# Altium schematic sheet digtal.SchDoc
size A4
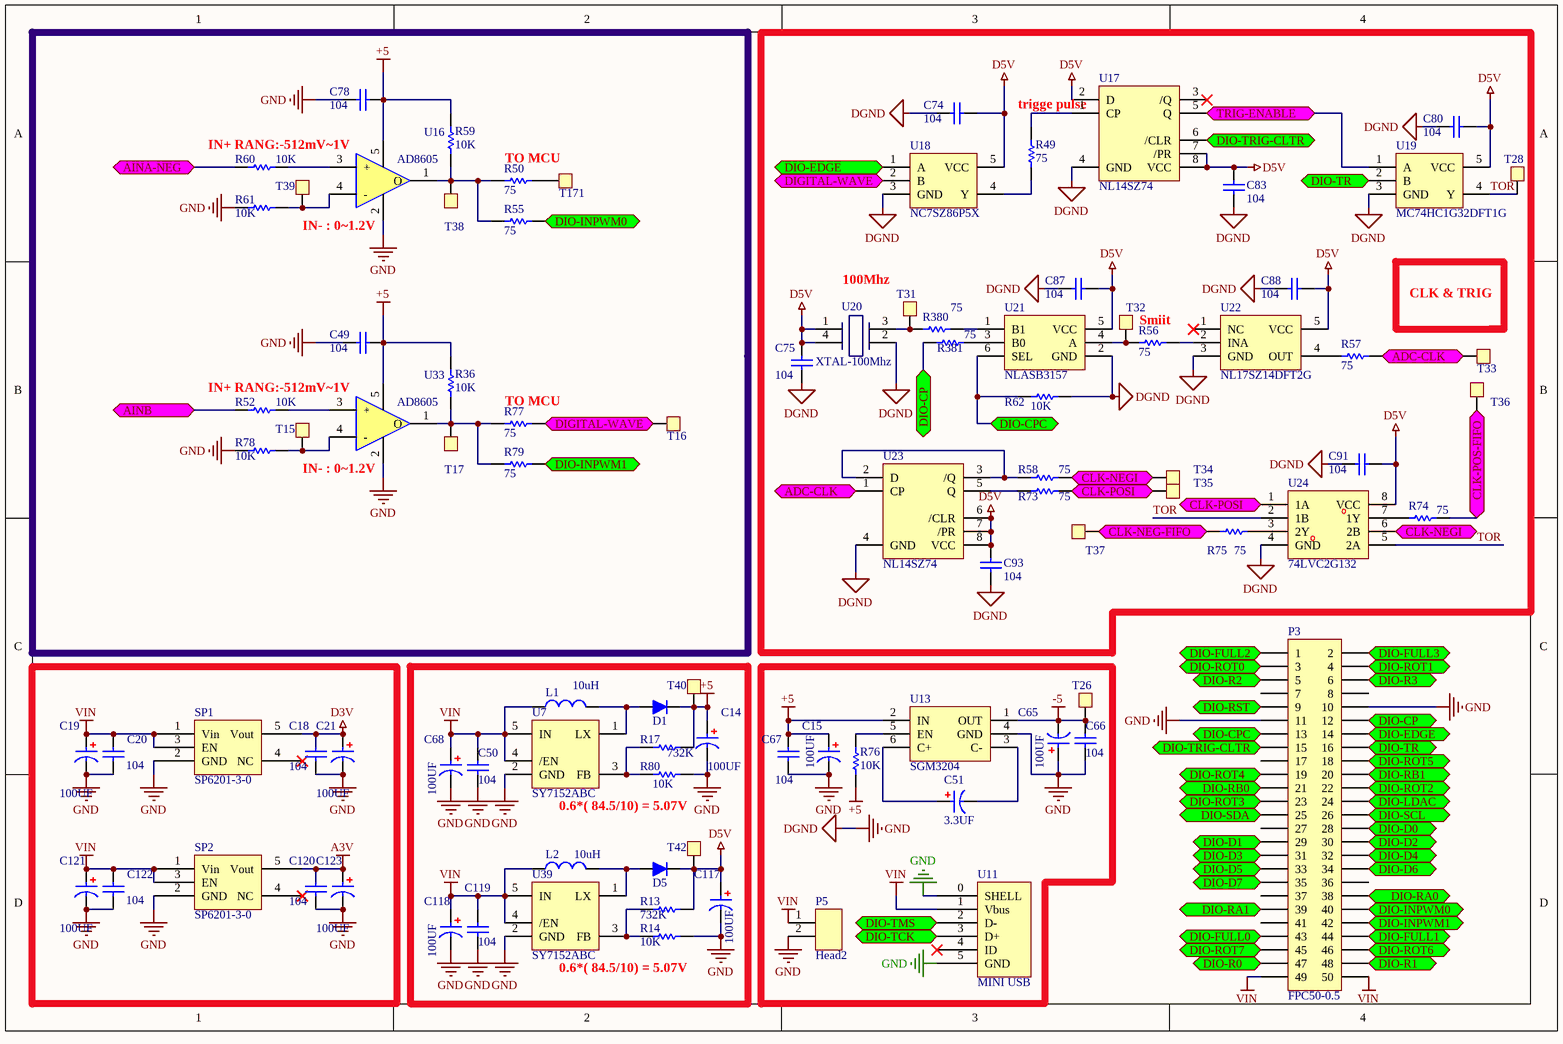
[diagram p0: digtal.SchDoc]

## Parts
C14  100UF  [CAP-T-3630]
C15  100UF  [CAP-T-3630]
C18  C104  [0402]  (value not drawn)
C19  100UF  [CAP-T-3630]
C20  C104  [0402]  (value not drawn)
C21  100UF  [CAP-T-3630]
C49  C104  [0402]  (value not drawn)
C50  C104  [0402]  (value not drawn)
C51  3.3UF  [0603C]
C65  100UF  [CAP-T-3630]
C66  C104  [0402]  (value not drawn)
C67  C104  [0402]  (value not drawn)
C68  100UF  [CAP-T-3630]
C74  C104  [0402]  (value not drawn)
C75  C104  [0402]  (value not drawn)
C78  C104  [0402]  (value not drawn)
C80  C104  [0402]  (value not drawn)
C83  C104  [0402]  (value not drawn)
C87  C104  [0402]  (value not drawn)
C88  C104  [0402]  (value not drawn)
C91  C104  [0402]  (value not drawn)
C93  C104  [0402]  (value not drawn)
C117  100UF  [CAP-T-3630]
C118  100UF  [CAP-T-3630]
C119  C104  [0402]  (value not drawn)
C120  C104  [0402]  (value not drawn)
C121  100UF  [CAP-T-3630]
C122  C104  [0402]  (value not drawn)
C123  100UF  [CAP-T-3630]
D1  1N5918WS  [SOD23-322F]  (value not drawn)
D5  1N5918WS  [SOD23-322F]  (value not drawn)
L1  10uH  [0805]
L2  10uH  [0805]
P3  FPC50-0.5  [FPC50-0.5]
P5  Head2  [HEAD2]
R13  732K  [0402]
R14  10K  [0402]
R17  732K  [0402]
R36  10K  [0402]
R49  75  [0402]
R50  75  [0402]
R52  10K  [0402]
R55  75  [0402]
R56  75  [0402]
R57  75  [0402]
R58  75  [0402]
R59  10K  [0402]
R60  10K  [0402]
R61  10K  [0402]
R62  10K  [0402]
R73  75  [0402]
R74  75  [0402]
R75  75  [0402]
R76  R10K  [0402]  (value not drawn)
R77  75  [0402]
R78  10K  [0402]
R79  75  [0402]
R80  10K  [0402]
R380  75  [0402]
R381  75  [0402]
SP1  SP6201-3-0  [SOT23-5]
SP2  SP6201-3-0  [SOT23-5]
T15  TP  [TEST_POINT]  (value not drawn)
T16  TP  [TEST_POINT]  (value not drawn)
T17  TP  [TEST_POINT]  (value not drawn)
T26  TP  [TEST_POINT]  (value not drawn)
T28  TP  [TEST_POINT]  (value not drawn)
T31  TP  [TEST_POINT]  (value not drawn)
T32  TP  [TEST_POINT]  (value not drawn)
T33  TP  [TEST_POINT]  (value not drawn)
T34  TP  [TEST_POINT]  (value not drawn)
T35  TP  [TEST_POINT]  (value not drawn)
T36  TP  [TEST_POINT]  (value not drawn)
T37  TP  [TEST_POINT]  (value not drawn)
T38  TP  [TEST_POINT]  (value not drawn)
T39  TP  [TEST_POINT]  (value not drawn)
T40  TP  [TEST_POINT]  (value not drawn)
T42  TP  [TEST_POINT]  (value not drawn)
T171  TP  [TEST_POINT]  (value not drawn)
U7  SY7152ABC  [SOT23-6]
U11  MINI USB  [Micro_USB_t]
U13  SGM3204  [SOT23-6]
U16  AD8605  [SOT23-5]
U17  NL14SZ74  [VFSOP-8]
U18  NC7SZ86P5X  [sc70-5]
U19  MC74HC1G32DFT1G  [SC70-5]
U20  XTAL-100Mhz  [7050]
U21  NLASB3157  [SC-88]
U22  NL17SZ14DFT2G  [SC70-5]
U23  NL14SZ74  [VFSOP-8]
U24  74LVC2G132  [VFSOP-8]
U33  AD8605  [SOT23-5]
U39  SY7152ABC  [SOT23-6]

## Ports
ADC-CLK, AINA-NEG, AINB, CLK-NEG-FIFO, CLK-NEGI, CLK-POS-FIFO, CLK-POSI, DIGITAL-WAVE, DIO-CP, DIO-CPC, DIO-D0, DIO-D1, DIO-D2, DIO-D3, DIO-D4, DIO-D5, DIO-D6, DIO-D7, DIO-EDGE, DIO-FULL0, DIO-FULL1, DIO-FULL2, DIO-FULL3, DIO-INPWM0, DIO-INPWM1, DIO-LDAC, DIO-R0, DIO-R1, DIO-R2, DIO-R3, DIO-RA0, DIO-RA1, DIO-RB0, DIO-RB1, DIO-ROT0, DIO-ROT1, DIO-ROT2, DIO-ROT3, DIO-ROT4, DIO-ROT5, DIO-ROT6, DIO-ROT7, DIO-RST, DIO-SCL, DIO-SDA, DIO-TCK, DIO-TMS, DIO-TR, DIO-TRIG-CLTR, TRIG-ENABLE

## Nets
+5: C14.1 C15.1 C49.1 C67.1 C78.1 D1.2(K) R17.2 R36.1 R59.1 R76.1 T40.1(R) U13.2(IN) U16.5(V+) U33.5(V+)
-5: C65.2 C66.1 T26.1(R) U13.1(OUT)
A3V: C120.1 C123.1 SP2.5(Vout)
D3V: C18.1 C21.1 SP1.5(Vout)
D5V: C74.1 C75.1 C80.1 C83.1 C87.1 C88.1 C91.1 C93.1 C117.1 D5.2(K) R13.2 T42.1(R) U17.2(D) U17.7(/PR) U17.8(VCC) U18.5(VCC) U19.5(VCC) U20.1 U20.4 U21.5(VCC) U22.5(VCC) U23.6(/CLR) U23.7(/PR) U23.8(VCC) U24.8(VCC)
DGND: C14.2 C15.2 C18.2 C19.2 C20.2 C21.2 C49.2 C50.2 C65.1 C66.2 C67.2 C68.2 C74.2 C75.2 C78.2 C80.2 C83.2 C87.2 C88.2 C91.2 C93.2 C117.2 C118.2 C119.2 C120.2 C121.2 C122.2 C123.2 P3.10 P3.11 P5.2 R14.1 R61.1 R62.2 R78.1 R80.1 SP1.2(GND) SP2.2(GND) U7.2(GND) U11.0(SHELL) U11.5(GND) U13.4(GND) U16.2(V-) U17.4(GND) U18.3(GND) U19.3(GND) U20.2 U21.2(GND) U22.3(GND) U23.4(GND) U24.4(GND) U33.2(V-) U39.2(GND)  [also labelled GND]
VIN: C19.1 C20.1 C50.1 C68.1 C118.1 C119.1 C121.1 C122.1 L1.1 L2.1 P3.49 P3.50 P5.1 SP1.1(Vin) SP1.3(EN) SP2.1(Vin) SP2.3(EN) U7.4(/EN) U7.5(IN) U11.1(Vbus) U39.4(/EN) U39.5(IN)
ADC-CLK: R57.1 T33.1(R) U23.1(CP) ; port ADC-CLK
AINA-NEG: R60.1 ; port AINA-NEG
AINB: R52.1 ; port AINB
CLK-NEG-FIFO: R75.2 T37.1(R) ; port CLK-NEG-FIFO
CLK-NEGI: R58.1 T34.1(R) U24.6(2B) ; port CLK-NEGI
CLK-POS-FIFO: R74.1 T36.1(R) ; port CLK-POS-FIFO
CLK-POSI: R73.1 T35.1(R) U24.1(1A) ; port CLK-POSI
DIGITAL-WAVE: R77.2 T16.1(R) U18.2(B) ; port DIGITAL-WAVE
DIO-CP: P3.12 R381.2 ; port DIO-CP
DIO-CPC: P3.13 R62.1 U21.6(SEL) ; port DIO-CPC
DIO-D0: P3.28 ; port DIO-D0
DIO-D1: P3.29 ; port DIO-D1
DIO-D2: P3.30 ; port DIO-D2
DIO-D3: P3.31 ; port DIO-D3
DIO-D4: P3.32 ; port DIO-D4
DIO-D5: P3.33 ; port DIO-D5
DIO-D6: P3.34 ; port DIO-D6
DIO-D7: P3.35 ; port DIO-D7
DIO-EDGE: P3.14 U18.1(A) ; port DIO-EDGE
DIO-FULL0: P3.43 ; port DIO-FULL0
DIO-FULL1: P3.44 ; port DIO-FULL1
DIO-FULL2: P3.1 ; port DIO-FULL2
DIO-FULL3: P3.2 ; port DIO-FULL3
DIO-INPWM0: P3.40 R55.2 ; port DIO-INPWM0
DIO-INPWM1: P3.42 R79.2 ; port DIO-INPWM1
DIO-LDAC: P3.24 ; port DIO-LDAC
DIO-R0: P3.47 ; port DIO-R0
DIO-R1: P3.48 ; port DIO-R1
DIO-R2: P3.5 ; port DIO-R2
DIO-R3: P3.6 ; port DIO-R3
DIO-RA0: P3.38 ; port DIO-RA0
DIO-RA1: P3.39 ; port DIO-RA1
DIO-RB0: P3.21 ; port DIO-RB0
DIO-RB1: P3.20 ; port DIO-RB1
DIO-ROT0: P3.3 ; port DIO-ROT0
DIO-ROT1: P3.4 ; port DIO-ROT1
DIO-ROT2: P3.22 ; port DIO-ROT2
DIO-ROT3: P3.23 ; port DIO-ROT3
DIO-ROT4: P3.19 ; port DIO-ROT4
DIO-ROT5: P3.18 ; port DIO-ROT5
DIO-ROT6: P3.46 ; port DIO-ROT6
DIO-ROT7: P3.45 ; port DIO-ROT7
DIO-RST: P3.9 ; port DIO-RST
DIO-SCL: P3.26 ; port DIO-SCL
DIO-SDA: P3.25 ; port DIO-SDA
DIO-TCK: U11.3(D+) ; port DIO-TCK
DIO-TMS: U11.2(D-) ; port DIO-TMS
DIO-TR: P3.16 U19.2(B) ; port DIO-TR
DIO-TRIG-CLTR: P3.15 U17.6(/CLR) ; port DIO-TRIG-CLTR
TOR: T28.1(R) U19.4(Y) U24.2(1B) U24.5(2A)
TRIG-ENABLE: U17.5(Q) U19.1(A) ; port TRIG-ENABLE
NetC51_1: C51.1 U13.6(C+)
NetC51_2: C51.2 U13.3(C-)
NetD1_1: D1.1(A) L1.2 U7.1(LX)
NetD5_1: D5.1(A) L2.2 U39.1(LX)
NetR13_1: R13.1 R14.2 U39.3(FB)
NetR17_1: R17.1 R80.2 U7.3(FB)
NetR36_2: R36.2 R77.1 R79.1 T17.1(R) U33.1(O)
NetR49_1: R49.1 U18.4(Y)
NetR49_2: R49.2 U17.1(CP)
NetR50_1: R50.1 R55.1 R59.2 T38.1(R) U16.1(O)
NetR50_2: R50.2 T171.1(R)
NetR52_2: R52.2 U33.3(+)
NetR56_1: R56.1 U22.2(INA)
NetR56_2: R56.2 T32.1(R) U21.4(A)
NetR57_2: R57.2 U22.4(OUT)
NetR58_2: R58.2 U23.2(D) U23.3(/Q)
NetR60_2: R60.2 U16.3(+)
NetR61_2: R61.2 T39.1(R) U16.4(-)
NetR73_2: R73.2 U23.5(Q)
NetR74_2: R74.2 U24.7(1Y)
NetR75_1: R75.1 U24.3(2Y)
NetR76_2: R76.2 U13.5(EN)
NetR78_2: R78.2 T15.1(R) U33.4(-)
NetR380_1: R380.1 U21.1(B1)
NetR380_2: R380.2 T31.1(R) U20.3
NetR381_1: R381.1 U21.3(B0)

Not connected (* = marked no-connect by the designer): P3 7 8 17 27 36 37 41; SP1 4(NC)*; SP2 4(NC)*; U7 6; U11 4(ID)*; U17 3(/Q)*; U22 1(NC)*; U39 6

## Notes on the sheet
- (near U17) trigge pulse
- (near R60) IN+ RANG:-512mV~1V
- TO MCU
- IN- : 0~1.2V
- 100Mhz
- CLK & TRIG
- Smiit
- (near R52) IN+ RANG:-512mV~1V
- (near R77) TO MCU
- 0.6*( 84.5/10) = 5.07V
- (in symbol C0.1uF) 104
- (in symbol R10K) 10K

## Library data of the parts
C14 C15 C19 C21 C51 C65 C68 C117 C118 C121 C123 = C10uF: 贴片电容
C18 C20 C49 C50 C66 C67 C74 C75 C78 C80 C83 C87 C88 C91 C93 C119 C120 C122 = C0.1uF: 贴片电容
D1 D5 = Diode
L1 L2 = Inductor-100uH
P3 = Header 25X2: Header, 25-Pin, Dual row; LatestRevisionDate: 17-Jul-2002; LatestRevisionNote: Re-released for DXP Platform.; Publisher: Altium Limited
R13 R14 R17 R36 R49 R50 R52 R55-R62 R73-R75 R77-R80 R380 R381 = R1M
SP1 SP2 = SP6201
U24 = 74LVC2G132DCUR